# Altium schematic sheet 4_PREP.schdoc
size 302 x 215 mm; Symbol: Sheet_A4; Device: Sheet_A4; @Project Name: Yuzuki Chameleon 基于H616的开发板; Company: YuzukiHD; Version: 1.0; @Page No: 4; @Page Count: 4; @Update Date: 2025-03-02; REV: 1.0; Date: 2021-09-08; Sheet: 1/1; Draw By: GloomyGhost; SheetNumber: 4; SheetTotal: 4
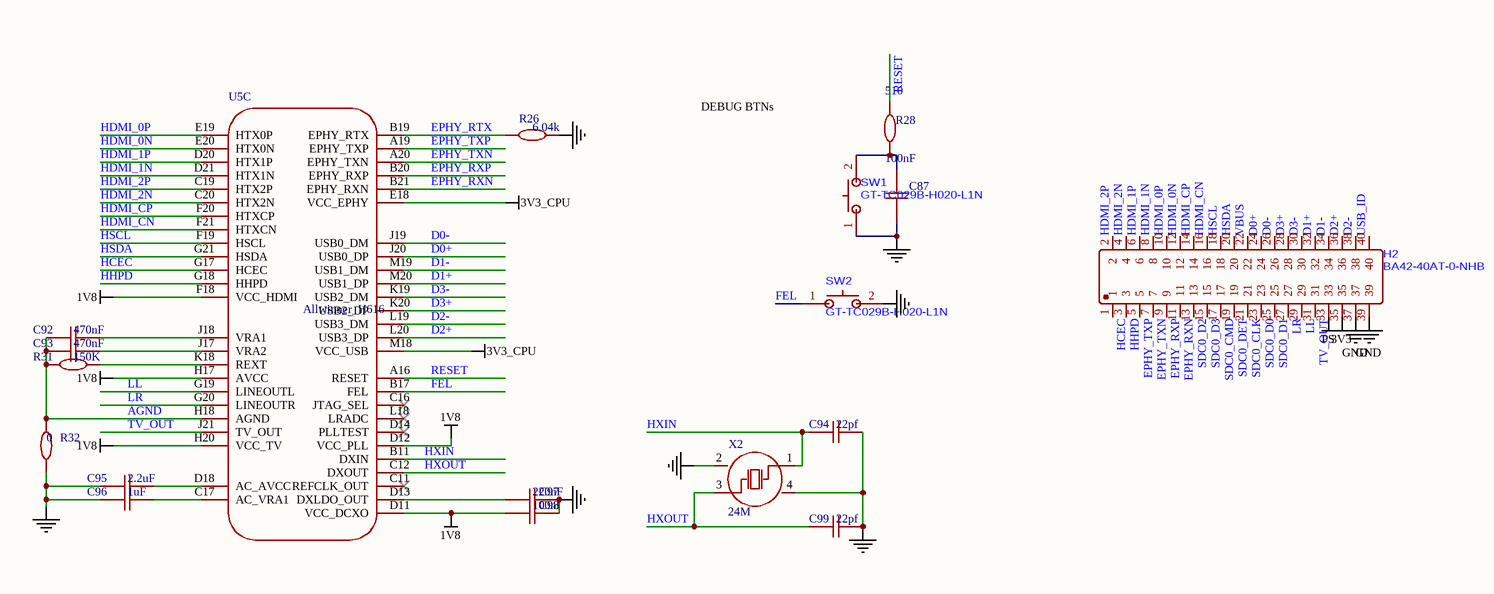
[diagram p0: 4_PREP.schdoc]

## Parts
C87  100nF  [C0402-NSK]
C92  470nF  [C0402]
C93  470nF  [C0402]
C94  22pf  [C0402]
C95  2.2uF  [C0402]
C96  1uF  [C0402]
C97  220nF  [C0402]
C98  100nf  [C0402]
C99  22pf  [C0402]
H2  BA42-40AT-0-NHB  [CONN-SMD_40P-P0.80_10144517-042802LF]
R26  6.04k  [R0402-NSK_2]
R28  510  [R0402-NSK_2]
R31  150K  [R0402-NSK_2]
R32  0  [R0402-NSK_2]
SW1  GT-TC029B-H020-L1N  [SW-SMD_L3.9-W2.9-P4.15-LS5.0]
SW2  GT-TC029B-H020-L1N  [SW-SMD_L3.9-W2.9-P4.15-LS5.0]
U5  Allwinner_H616  [BGA284P65B1200_1400H125]  (part C of 4)
X2  24M  [OSC-SMD_4P-L2.0-W1.6-BL]

## Nets
1V8: C98.1 U5.D11(VCC_DCXO) U5.D12(VCC_PLL) U5.F18(VCC_HDMI) U5.H17(AVCC) U5.H20(VCC_TV)
3V3: H2.35
3V3_CPU: U5.E18(VCC_EPHY) U5.M18(VCC_USB)
GND: C87.1 C94.2 C95.1 C96.1 C97.2 C98.2 C99.2 H2.37 H2.39 R26.2 R32.1 SW1.1 SW2.2 X2.2(GND) X2.4(GND)
PS: H2.33
AGND: C92.1 C93.1 R31.1 R32.2 U5.H18(AGND)
D0+: H2.24 U5.J20(USB0_DP)
D0-: H2.26 U5.J19(USB0_DM)
D1+: H2.32 U5.M20(USB1_DP)
D1-: H2.34 U5.M19(USB1_DM)
D2+: H2.36 U5.L20(USB3_DP)
D2-: H2.38 U5.L19(USB3_DM)
D3+: H2.28 U5.K20(USB2_DP)
D3-: H2.30 U5.K19(USB2_DM)
EPHY_RTX: R26.1 U5.B19(EPHY_RTX)
EPHY_RXN: H2.11 U5.B21(EPHY_RXN)
EPHY_RXP: H2.9 U5.B20(EPHY_RXP)
EPHY_TXN: H2.7 U5.A20(EPHY_TXN)
EPHY_TXP: H2.5 U5.A19(EPHY_TXP)
FEL: SW2.1 U5.B17(FEL)
HCEC: H2.1 U5.G17(HCEC)
HDMI_0N: H2.12 U5.E20(HTX0N)
HDMI_0P: H2.10 U5.E19(HTX0P)
HDMI_1N: H2.8 U5.D21(HTX1N)
HDMI_1P: H2.6 U5.D20(HTX1P)
HDMI_2N: H2.4 U5.C20(HTX2N)
HDMI_2P: H2.2 U5.C19(HTX2P)
HDMI_CN: H2.16 U5.F21(HTXCN)
HDMI_CP: H2.14 U5.F20(HTXCP)
HHPD: H2.3 U5.G18(HHPD)
HSCL: H2.18 U5.F19(HSCL)
HSDA: H2.20 U5.G21(HSDA)
HXIN: C94.1 U5.B11(DXIN) X2.1(OSC1)
HXOUT: C99.1 U5.C12(DXOUT) X2.3(OSC2)
LL: H2.29 U5.G19(LINEOUTL)
LR: H2.27 U5.G20(LINEOUTR)
RESET: R28.1 U5.A16(RESET)
SDC0_CLK: H2.21
SDC0_CMD: H2.17
SDC0_D0: H2.23
SDC0_D1: H2.25
SDC0_D2: H2.13
SDC0_D3: H2.15
SDC0_DET: H2.19
TV_OUT: H2.31 U5.J21(TV_OUT)
USB_ID: H2.40
VBUS: H2.22
NetC87_2: C87.2 R28.2 SW1.2
NetC92_2: C92.2 U5.J18(VRA1)
NetC93_2: C93.2 U5.J17(VRA2)
NetC95_2: C95.2 U5.D18(AC_AVCC)
NetC96_2: C96.2 U5.C17(AC_VRA1)
NetC97_1: C97.1 U5.D13(DXLDO_OUT)
NetR31_2: R31.2 U5.K18(REXT)

Not connected (* = marked no-connect by the designer): U5 C11(REFCLK_OUT)* C16(JTAG_SEL)* D14(PLLTEST)* L18(LRADC)*

## Notes on the sheet
- DEBUG BTNs
- 1
- 2
- 3
- 4
- 5
- A
- B
- C
- D
- TITLE:
- Yuzuki Chameleon 基于H616的开发板
- REV:
- 1.0
- Company:
- Date:
- 2025-03-02
- 2021-09-08
- YuzukiHD
- Sheet:
- Drawn By:
- GloomyGhost
- Total:
- 1/1

## Library data of the parts
C87 = FN15X104K250PNG
C92-C99 = CAP_0402
R26 R31 R32 = Res_0402
R28 = TR0402D10K0Q1025Z
X2 = SX32Y024000BC1T